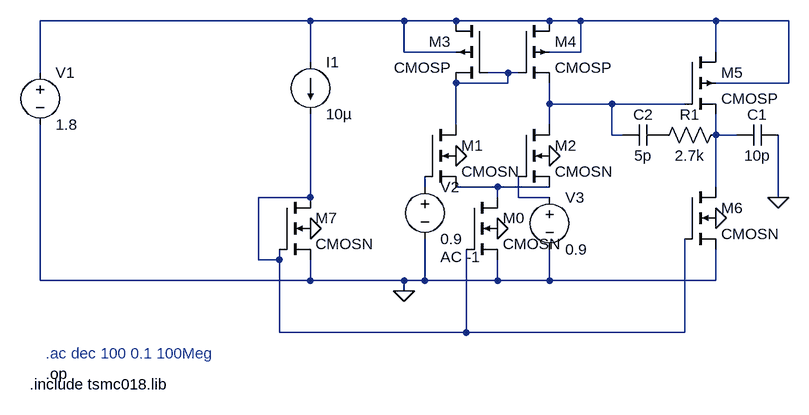
[diagram p0: schematic opamp.asc]
opamp.asc, the LTspice schematic file:
Version 4.1
SHEET 1 2324 1020
WIRE 144 112 -272 112
WIRE 288 112 144 112
WIRE 368 112 288 112
WIRE 512 112 368 112
WIRE 560 112 512 112
WIRE 768 112 560 112
WIRE 880 112 768 112
WIRE 288 160 288 112
WIRE 368 160 288 160
WIRE 560 160 560 112
WIRE 560 160 512 160
WIRE 768 160 768 112
WIRE 144 176 144 112
WIRE -272 192 -272 112
WIRE 448 192 416 192
WIRE 464 192 448 192
WIRE 448 208 448 192
WIRE 448 208 368 208
WIRE 880 208 880 112
WIRE 880 208 768 208
WIRE 512 240 512 208
WIRE 608 240 512 240
WIRE 720 240 608 240
WIRE 368 272 368 208
WIRE 512 272 512 240
WIRE 608 288 608 240
WIRE 624 288 608 288
WIRE 768 288 768 256
WIRE 800 288 768 288
WIRE 320 368 320 352
WIRE 432 368 368 368
WIRE 512 368 432 368
WIRE 768 368 768 288
WIRE 144 384 144 256
WIRE 144 384 64 384
WIRE 432 384 432 368
WIRE 464 384 464 352
WIRE 512 384 464 384
WIRE 864 384 864 288
WIRE 144 400 144 384
WIRE 64 480 64 384
WIRE 96 480 96 464
WIRE 96 480 64 480
WIRE -272 512 -272 272
WIRE 144 512 144 480
WIRE 144 512 -272 512
WIRE 288 512 144 512
WIRE 320 512 320 448
WIRE 320 512 288 512
WIRE 432 512 432 480
WIRE 432 512 320 512
WIRE 512 512 512 464
WIRE 512 512 432 512
WIRE 768 512 768 464
WIRE 768 512 512 512
WIRE 288 528 288 512
WIRE 96 592 96 480
WIRE 384 592 384 464
WIRE 384 592 96 592
WIRE 720 592 720 448
WIRE 720 592 384 592
FLAG 144 432 0
FLAG 432 432 0
FLAG 288 528 0
FLAG 512 320 0
FLAG 368 320 0
FLAG 768 416 0
FLAG 864 384 0
SYMBOL cmosn 96 384 R0
SYMATTR InstName M7
SYMATTR Value2 l=1u w=2.5u
SYMBOL cmosn 384 384 R0
SYMATTR InstName M0
SYMATTR Value2 l=1u w=25u
SYMBOL voltage -272 176 R0
WINDOW 123 0 0 Left 0
WINDOW 39 0 0 Left 0
SYMATTR InstName V1
SYMATTR Value 1.8
SYMBOL cmosn 320 272 R0
SYMATTR InstName M1
SYMATTR Value2 l=1u w=15u
SYMBOL cmosn 464 272 R0
SYMATTR InstName M2
SYMATTR Value2 l=1u w=15u
SYMBOL cmosp 416 112 M0
SYMATTR InstName M3
SYMATTR Value2 l=1u w=25u
SYMBOL cmosp 464 112 R0
SYMATTR InstName M4
SYMATTR Value2 l=1u w=25u
SYMBOL voltage 320 352 R0
WINDOW 123 24 124 Left 2
WINDOW 39 0 0 Left 0
SYMATTR Value2 AC -1
SYMATTR InstName V2
SYMATTR Value 0.9
SYMBOL cmosp 720 160 R0
SYMATTR InstName M5
SYMATTR Value2 l=1u w=50u
SYMBOL cmosn 720 368 R0
SYMATTR InstName M6
SYMATTR Value2 l=1u w=25u
SYMBOL voltage 512 368 R0
WINDOW 123 24 124 Left 2
WINDOW 39 0 0 Left 0
SYMATTR InstName V3
SYMATTR Value 0.9
SYMBOL current 144 176 R0
WINDOW 123 0 0 Left 0
WINDOW 39 0 0 Left 0
SYMATTR InstName I1
SYMATTR Value 10µ
SYMBOL cap 800 304 R270
WINDOW 0 32 32 VTop 2
WINDOW 3 0 32 VBottom 2
SYMATTR InstName C1
SYMATTR Value 10p
SYMBOL cap 688 272 R90
WINDOW 0 0 32 VBottom 2
WINDOW 3 32 32 VTop 2
SYMATTR InstName C2
SYMATTR Value 5p
SYMBOL res 784 272 R90
WINDOW 0 0 56 VBottom 2
WINDOW 3 32 56 VTop 2
SYMATTR InstName R1
SYMATTR Value 2.7k
TEXT -288 672 Left 2 !.include tsmc018.lib
TEXT -264 624 Left 2 ;.ac dec 100 0.1 100Meg
TEXT -264 656 Left 2 !.op

The netlist it stands for:
* opamp.asc
M7 N007 N007 0 0 CMOSN l=1u w=2.5u
M0 N006 N007 0 0 CMOSN l=1u w=25u
V1 N001 0 1.8
M1 N002 N005 N006 0 CMOSN l=1u w=15u
M2 N003 N008 N006 0 CMOSN l=1u w=15u
M3 N001 N002 N002 N001 CMOSP l=1u w=25u
M4 N001 N002 N003 N001 CMOSP l=1u w=25u
V2 N005 0 0.9 AC -1
M5 N001 N003 N004 N001 CMOSP l=1u w=50u
M6 N004 N007 0 0 CMOSN l=1u w=25u
V3 N008 0 0.9
I1 N001 N007 10µ
C1 N004 0 10p
C2 P001 N003 5p
R1 N004 P001 2.7k
.model NMOS NMOS
.model PMOS PMOS
.lib standard.mos
.include tsmc018.lib
* .ac dec 100 0.1 100Meg
.op
.backanno
.end